# Altium schematic sheet PowerSupply.SchDoc
size A
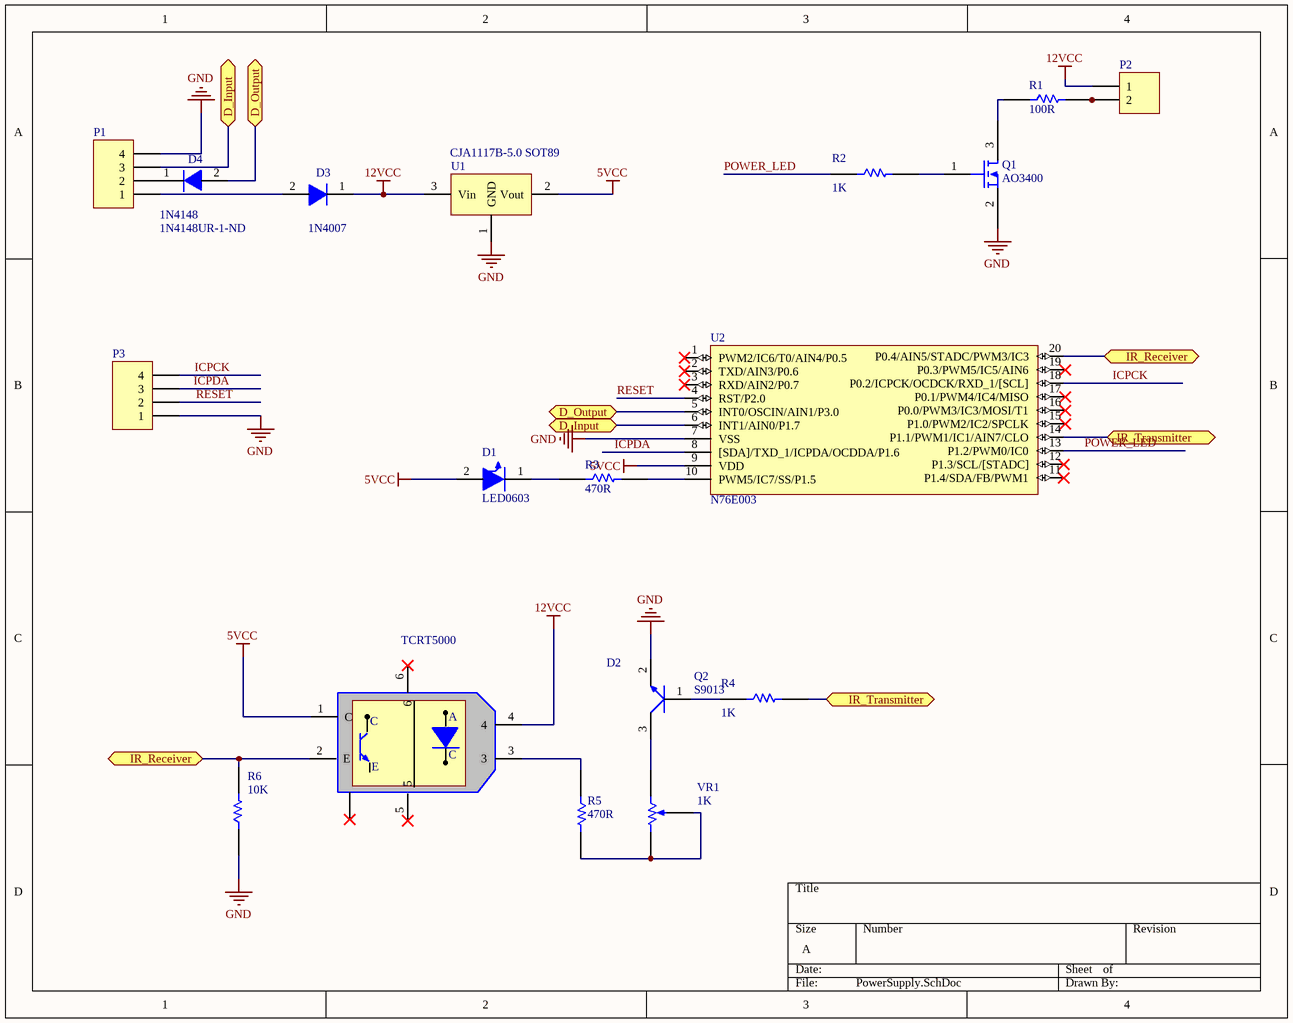
[diagram p0: PowerSupply.SchDoc]

## Parts
D1  LED0603  [DIOC1608X06N]
D2  TCRT5000  [TCRT5000]
D3  1N4007  [SODFL504X244-2N]
D4  1N4148  Supplier Part Number 1: 1N4148UR-1-ND  [DIOMELF3515N]
P1  (no value)  [HDR1X4H]
P2  (no value)  [HDR1X2]
P3  (no value)  [HDR1X4]
Q1  AO3400  [SOT95P278X125-3N]
Q2  S9013  [SOT95P278X125-3N]
R1  100R  [RESC2608X06N_0603]
R2  1K  [RESC2608X06N_0603]
R3  470R  [RESC2608X06N_0603]
R4  1K  [RESC2608X06N_0603]
R5  470R  [RESC2608X06N_0603]
R6  10K  [RESC2608X06N_0603]
U1  CJA1117B-5.0 SOT89  [SOT89-150P409X160-3N]
U2  N76E003  [TSOP65P640X120-20N]
VR1  1K  [Var_SMD_3x3]

## Ports
D_Input, D_Output, IR_Receiver, IR_Transmitter

## Nets
5VCC: D1.2(C) D2.1(C) U1.2(Vout) U2.9(VDD)
12VCC: D2.4 D3.1(C) P2.1 U1.3(Vin)
GND: P1.4 P3.1 Q1.2(S) Q2.2(C) R6.1 U1.1(GND) U2.7(VSS)
D_Input: P1.3 U2.6(INT1/AIN0/P1.7) ; port D_Input
D_Output: D4.2(A) U2.5(INT0/OSCIN/AIN1/P3.0) ; port D_Output
ICPCK: P3.4 U2.18(P0.2/ICPCK/OCDCK/RXD_1/[SCL])
ICPDA: P3.3 U2.8([SDA]/TXD_1/ICPDA/OCDDA/P1.6)
IR_Receiver: D2.2(E) R6.2 U2.20(P0.4/AIN5/STADC/PWM3/IC3) ; port IR_Receiver
IR_Transmitter: R4.2 U2.14(P1.1/PWM1/IC1/AIN7/CLO) ; port IR_Transmitter
POWER_LED: R2.1 U2.13(P1.2/PWM0/IC0)
RESET: P3.2 U2.4(RST/P2.0)
NetD1_1: D1.1(A) R3.1
NetD2_3: D2.3 R5.1
NetD3_2: D3.2(A) P1.1
NetP2_2: P2.2 R1.2
NetQ1_1: Q1.1(G) R2.2
NetQ1_3: Q1.3(D) R1.1
NetQ2_1: Q2.1(B) R4.1
NetQ2_3: Q2.3 VR1.1
NetR3_2: R3.2 U2.10(PWM5/IC7/SS/P1.5)
NetR5_2: R5.2 VR1.2 VR1.3

Not connected (* = marked no-connect by the designer): D2 5* 6* 7*; D4 1(C); P1 2; U2 1(PWM2/IC6/T0/AIN4/P0.5)* 2(TXD/AIN3/P0.6)* 3(RXD/AIN2/P0.7)* 11(P1.4/SDA/FB/PWM1)* 12(P1.3/SCL/[STADC])* 15(P1.0/PWM2/IC2/SPCLK) 16(P0.0/PWM3/IC3/MOSI/T1) 17(P0.1/PWM4/IC4/MISO) 19(P0.3/PWM5/IC5/AIN6)

## Notes on the sheet
- (in symbol TCRT5000) A

## Library data of the parts
D3 = 1N4007_SMD Diode: 1N4007_SMD
D4 = 1N4148_SMD: DIODE GEN PURP 75V 200MA DO213AA; Supplier 1: Digi-Key
P1 = Header 4H: Header, 4-Pin, Right Angle; LatestRevisionDate: 17-Jul-2002; LatestRevisionNote: Re-released for DXP Platform.; Publisher: Altium Limited
P2 = Header 2: Header, 2-Pin; LatestRevisionDate: 17-Jul-2002; LatestRevisionNote: Re-released for DXP Platform.; Publisher: Altium Limited
P3 = Header 4: Header, 4-Pin; LatestRevisionDate: 17-Jul-2002; LatestRevisionNote: Re-released for DXP Platform.; Publisher: Altium Limited
Q1 = AO3400  MOSFET SOT23-3
Q2 = Transitor S9013 NPN: SOT-23 Plastic-Encapsulate Transistors
R1 = R100_0603_5%: Thick Film Resistors - SMD 0603 100OHMS 5% 1/10WATT; Supplier 1: Digi-Key; Supplier Part Number 1: CR0603-JW-101ELFCT-ND
R2 R4 = 1k_0603_5%: Thick Film Resistors - SMD 0603 1kOHMS 5% 1/10WATT; Supplier 1: Digi-Key; Supplier Part Number 1: CR0603-JW-101ELFCT-ND
R3 R5 = R470_0603_5%: Thick Film Resistors - SMD 470 ohm 5%; Supplier 1: Digi-Key; Supplier Part Number 1: CR0603-JW-471ELFCT-ND
R6 = R10k_0603_5%: RES SMD 10K OHM 1% 1/4W 0603; Supplier 1: Digi-Key; Supplier Part Number 1: 541-10.0KSCT-ND
U1 = CJA1117B-5.0 SOT89: CJA1117B-5.0 SOT89 Power IC 1A 5V_IC
U2 = N76E003: IC MCU 8BIT 18KB FLASH 20TSSOP; Value: STM8S003F3; Supplier Part Number 1: 497-18051-1-ND
VR1 = Varistor 3x3 SMD 1KOhm: Varistor 3x3 SMD 1KOhm 5% 1/10WATT; Supplier 1: Digi-Key; Supplier Part Number 1: CR0603-JW-101ELFCT-ND